# EAGLE schematic Ground Station 2019-2020 (EAGLE 9.1.3)
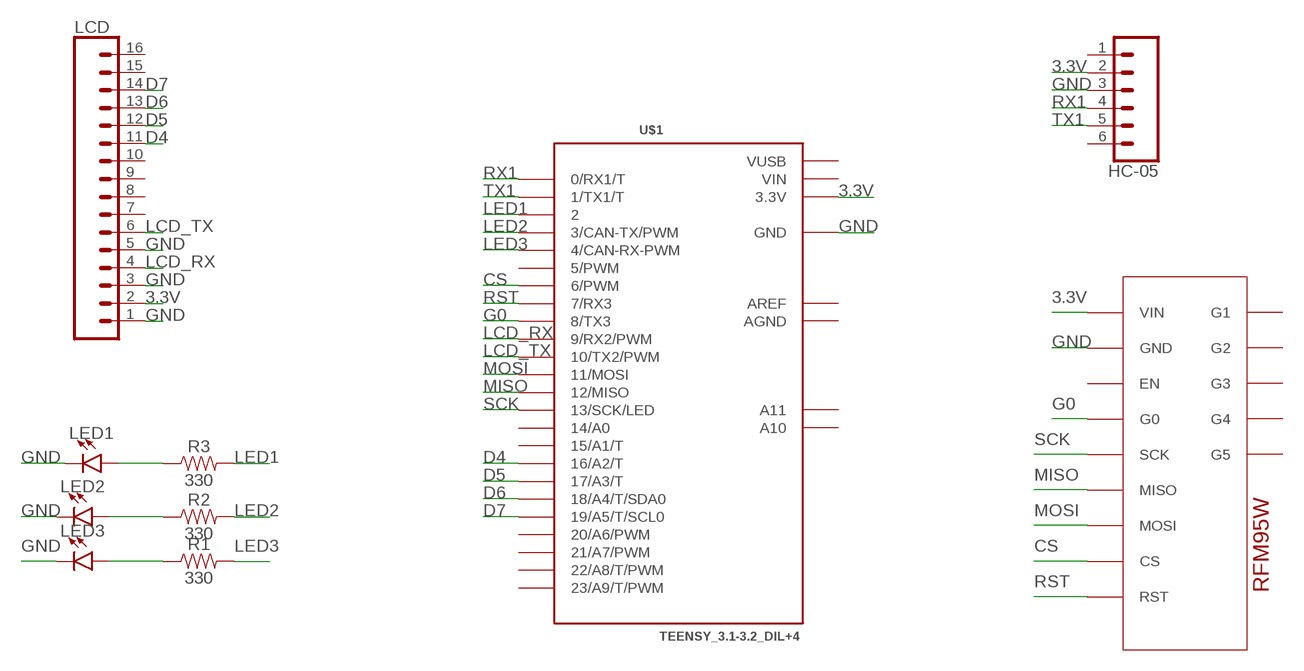
[diagram p0: schematic, sheet 1]

## Parts
HC-05  CONN_06SILK_FEMALE_PTH  [1X06]
LCD  CONN_16  [1X16]
LED1  LED5MM  [LED_5MM]
LED2  LED5MM  [LED_5MM]
LED3  LED5MM  [LED_5MM]
R1  330  330OHM-HORIZ-1/10W-5%  [AXIAL-0.3]
R2  330  330OHM-HORIZ-1/10W-5%  [AXIAL-0.3]
R3  330  330OHM-HORIZ-1/10W-5%  [AXIAL-0.3]
U1  ADAFRUIT_RFM95W_LORA_RADIO  [ADAFRUIT_RFM95W_LORA_RADIO]
U$1  TEENSY_3.1-3.2_DIL+4  [TEENSY_3.0-3.2&LC_DIL+4]

## Nets
3.3V: HC-05.2 LCD.2 U1.1(VIN) U$1.3.3V
CS: U1.8(CS) U$1.6(6/PWM)
D4: LCD.11 U$1.16/A2(16/A2/T)
D5: LCD.12 U$1.17/A3(17/A3/T)
D6: LCD.13 U$1.18/A4(18/A4/T/SDA0)
D7: LCD.14 U$1.19/A5(19/A5/T/SCL0)
G0: U1.4(G0) U$1.8(8/TX3)
GND: HC-05.3 LCD.1 LCD.3 LCD.5 LED1.K(C) LED2.K(C) LED3.K(C) U1.2(GND) U$1.GND
LCD_RX: LCD.4 U$1.9(9/RX2/PWM)
LCD_TX: LCD.6 U$1.10(10/TX2/PWM)
LED1: R3.P$2 U$1.2
LED2: R2.P$2 U$1.3(3/CAN-TX/PWM)
LED3: R1.P$2 U$1.4(4/CAN-RX-PWM)
MISO: U1.6(MISO) U$1.12(12/MISO)
MOSI: U1.7(MOSI) U$1.11(11/MOSI)
N$1: LED3.A R1.P$1
N$2: LED2.A R2.P$1
N$3: LED1.A R3.P$1
RST: U1.9(RST) U$1.7(7/RX3)
RX1: HC-05.4 U$1.0(0/RX1/T)
SCK: U1.5(SCK) U$1.13(13/SCK/LED)
TX1: HC-05.5 U$1.1(1/TX1/T)
Unconnected: HC-05.1 HC-05.6 LCD.7 LCD.8 LCD.9 LCD.10 LCD.15 LCD.16 U1.3(EN) U1.10(G1) U1.11(G2) U1.12(G3) U1.13(G4) U1.14(G5) U$1.5(5/PWM) U$1.14/A0 U$1.15/A1(15/A1/T) U$1.20/A6(20/A6/PWM) U$1.21/A7(21/A7/PWM) U$1.22/A8(22/A8/T/PWM) U$1.23/A9(23/A9/T/PWM) U$1.A10 U$1.A11

## Power pins joined to a net without a drawn wire
AGND: U$1.AGND
AREF: U$1.AREF
VIN: U$1.VIN
VUSB: U$1.VUSB

## Library data of the parts
HC-05 = SparkFun-Connectors:CONN_06: Multi connection point. Often used as Generic Header-pin footprint for 0.1 inch spaced/style header connections On any of the 0.1 inch spaced packages, you can populate with these: Break Away Headers - Straight <https://www.sparkfun.com/products/116> (PRT-00116) Break Away Male Headers - Right Angle <https://www.sparkfun.com/products/553> (PRT-00553) Female Headers <https://www.sparkfun.com/products/115> (PRT-00115) Break Away Headers - Machine Pin <https://www.sparkfun.com/products/117> (PRT-00117) Break Away Female Headers - Swiss Machine Pin <https://www.sparkfun.com/products/743> (PRT-00743) Arduino Stackable Header - 6 Pin <https://www.sparkfun.com/products/9280> (PRT-09280) For SCREWTERMINALS and SPRING TERMINALS visit here: Screw Terimnals on SparkFun.com <https://www.sparkfun.com/search/results?term=Screw+Terminals> (5mm/3.5mm/2.54mm spacing) This device is also useful as a general connection point to wire up your design to another part of your project. Our various solder wires solder well into these plated through hole pads. Hook-Up Wire - Assortment (Stranded, 22 AWG) <https://www.sparkfun.com/products/11375> (PRT-11375) Hook-Up Wire - Assortment (Solid Core, 22 AWG) <https://www.sparkfun.com/products/11367> (PRT-11367) View the entire wire category on our website here <https://www.sparkfun.com/categories/141>; PROD_ID: CONN-08437
LCD = SparkFun-Connectors:CONN_16: Multi connection point. Often used as Generic Header-pin footprint for 0.1 inch spaced/style header connections On any of the 0.1 inch spaced packages, you can populate with these: Break Away Headers - Straight <https://www.sparkfun.com/products/116> (PRT-00116) Break Away Male Headers - Right Angle <https://www.sparkfun.com/products/553> (PRT-00553) Female Headers <https://www.sparkfun.com/products/115> (PRT-00115) Break Away Headers - Machine Pin <https://www.sparkfun.com/products/117> (PRT-00117) Break Away Female Headers - Swiss Machine Pin <https://www.sparkfun.com/products/743> (PRT-00743) For SCREWTERMINALS and SPRING TERMINALS visit here: Screw Terimnals on SparkFun.com <https://www.sparkfun.com/search/results?term=Screw+Terminals> (5mm/3.5mm/2.54mm spacing) This device is also useful as a general connection point to wire up your design to another part of your project. Our various solder wires solder well into these plated through hole pads. Hook-Up Wire - Assortment (Stranded, 22 AWG) <https://www.sparkfun.com/products/11375> (PRT-11375) Hook-Up Wire - Assortment (Solid Core, 22 AWG) <https://www.sparkfun.com/products/11367> (PRT-11367) View the entire wire category on our website here <https://www.sparkfun.com/categories/141> Special notes: Molex polarized connector foot print use with SKU : PRT-08231 with associated crimp pins and housings. 1MM SMD Version SKU: PRT-10208 NOTES ON THE VARIANTS LOCK and LOCK_LONGPADS... This footprint was designed to help hold the alignment of a through-hole component (i.e. 6-pin header) while soldering it into place. You may notice that each hole has been shifted either up or down by 0.005 of an inch from it's more standard position (which is a perfectly straight line). This slight alteration caused the pins (the squares in the middle) to touch the edges of the holes. Because they are alternating, it causes a "brace" to hold the component in place. 0.005 has proven to be the perfect amount of "off-center" position when using our standard breakaway headers. Although looks a little odd when you look at the bare footprint, once you have a header in there, the alteration is very hard to notice. Also,if you push a header all the way into place, it is covered up entirely on the bottom side.
LED1-LED3 = SparkFun-LED:LED: LED (Generic) Standard schematic elements and footprints for 5mm, 3mm, 1206, and 0603 sized LEDs. Generic LEDs with no color specified.
R1-R3 = SparkFun-Resistors:330OHM: 330Ω resistor A resistor is a passive two-terminal electrical component that implements electrical resistance as a circuit element. Resistors act to reduce current flow, and, at the same time, act to lower voltage levels within circuits. - Wikipedia; PROD_ID: RES-8371
U1 = AERO_Eagle_Library:ADAFRUIT_RFM95W_LORA_RADIO: Adafruit's LoRa Radio: RFM95W https://www.adafruit.com/product/3072
U$1 = Teensy_3_and_LC_Series_Boards_v1.4:TEENSY_3.1-3.2_DIL+4: Teensy 3.1 and 3.2 in a DIL package with the inner 4 pins